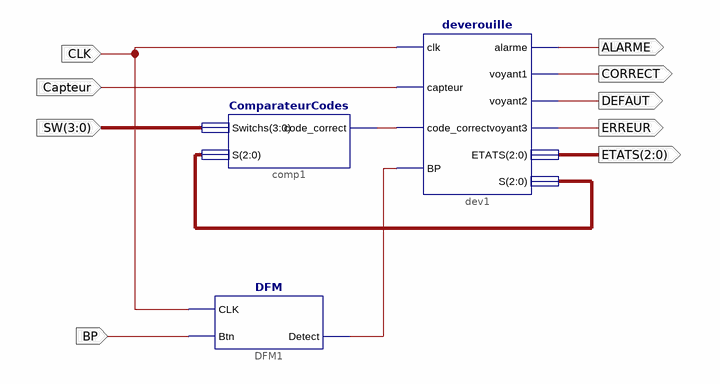
[diagram p0: schematic sheet 1]
// Xilinx ISE schematic gestionDeverouillage.sch (spartan3e) as structural Verilog: 3 symbols, 9 ports
module gestionDeverouillage (
  input  [3:0] SW,
  input  Capteur,
  input  CLK,
  input  BP,
  output CORRECT,
  output DEFAUT,
  output ERREUR,
  output ALARME,
  output [2:0] ETATS
);

  wire XLXN_1, XLXN_53;
  wire [2:0] XLXN_13;

  DFM DFM1 (.CLK(CLK), .Btn(BP), .Detect(XLXN_53));
  ComparateurCodes comp1 (.Switchs(SW), .S(XLXN_13), .code_correct(XLXN_1));
  deverouille dev1 (
    .clk(CLK), .capteur(Capteur), .code_correct(XLXN_1), .BP(XLXN_53), .alarme(ALARME), .voyant1(CORRECT),
    .voyant2(DEFAUT), .voyant3(ERREUR), .ETATS(ETATS), .S(XLXN_13));
endmodule
